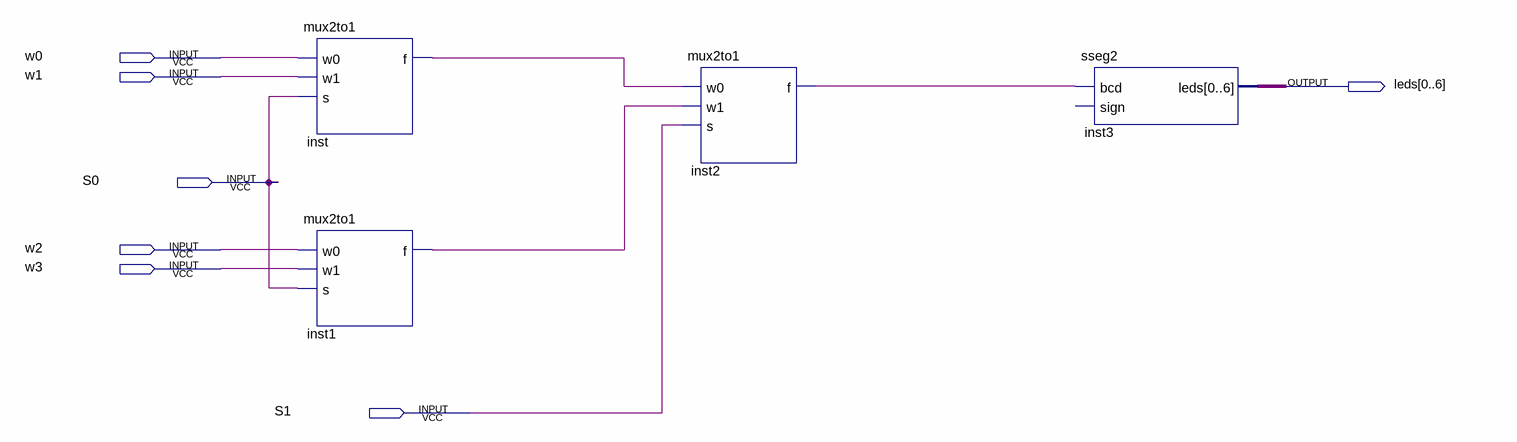
[diagram p0: schematic sheet]
// Quartus schematic muxModified.bdf as structural Verilog: 4 symbols, 7 pins
module muxModified (
  input  w0,
  input  w1,
  input  S0,
  input  w2,
  input  w3,
  input  S1,
  output [0:6] leds
);

  wire inst1_f, inst2_f, inst_f;

  mux2to1 inst (.w0(w0), .w1(w1), .s(S0), .f(inst_f));
  mux2to1 inst1 (.w0(w2), .w1(w3), .s(S0), .f(inst1_f));
  mux2to1 inst2 (.w0(inst_f), .w1(inst1_f), .s(S1), .f(inst2_f));
  sseg2 inst3 (.bcd(inst2_f), .leds(leds));  // open: sign
endmodule
